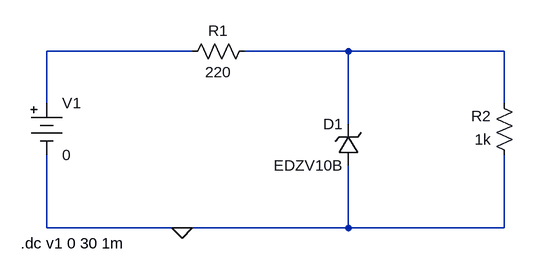
[diagram p0: schematic regulator.asc]
regulator.asc, the LTspice schematic file:
Version 4
SHEET 1 880 680
WIRE 336 32 112 32
WIRE 576 32 416 32
WIRE 816 32 576 32
WIRE 112 112 112 32
WIRE 816 112 816 32
WIRE 576 144 576 32
WIRE 112 304 112 192
WIRE 320 304 112 304
WIRE 576 304 576 208
WIRE 576 304 320 304
WIRE 816 304 816 192
WIRE 816 304 576 304
FLAG 320 304 0
SYMBOL Misc\\battery 112 96 R0
WINDOW 123 0 0 Left 0
WINDOW 39 0 0 Left 0
SYMATTR InstName V1
SYMATTR Value 0
SYMBOL res 432 16 R90
WINDOW 0 0 56 VBottom 2
WINDOW 3 32 56 VTop 2
SYMATTR InstName R1
SYMATTR Value 220
SYMBOL res 832 208 R180
WINDOW 0 36 76 Left 2
WINDOW 3 36 40 Left 2
SYMATTR InstName R2
SYMATTR Value 1k
SYMBOL zener 592 208 R180
WINDOW 0 24 64 Left 2
WINDOW 3 24 0 Left 2
SYMATTR InstName D1
SYMATTR Value EDZV10B
SYMATTR Description Diode
SYMATTR Type diode
TEXT 72 328 Left 2 !.dc v1 0 30 1m

The netlist it stands for:
* regulator.asc
V1 N001 0 0
R1 N002 N001 220
R2 0 N002 1k
D1 0 N002 EDZV10B
.model D D
.lib standard.dio
.dc v1 0 30 1m
.backanno
.end